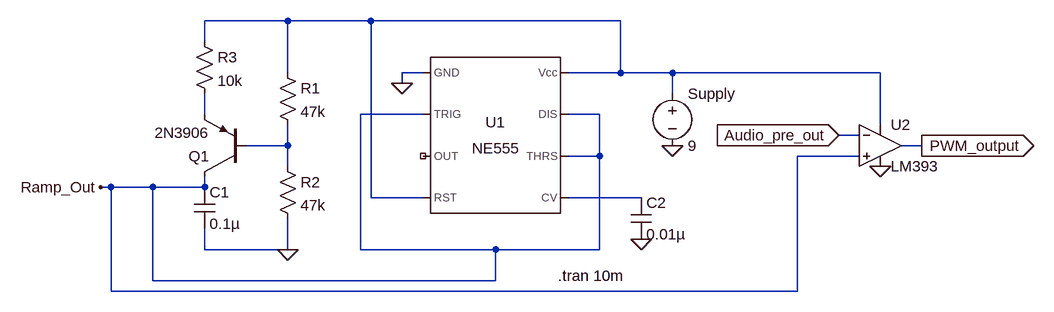
[diagram p0: schematic Tx.asc]
Tx.asc, the LTspice schematic file:
Version 4
SHEET 1 900 680
WIRE -288 -48 -416 -48
WIRE -160 -48 -288 -48
WIRE 224 -48 -160 -48
WIRE -416 -16 -416 -48
WIRE -288 32 -288 -48
WIRE -80 32 -112 32
WIRE 224 32 224 -48
WIRE 224 32 144 32
WIRE 304 32 224 32
WIRE 624 32 304 32
WIRE -112 48 -112 32
WIRE 304 64 304 32
WIRE -416 96 -416 64
WIRE -80 96 -176 96
WIRE 192 96 144 96
WIRE 624 112 624 32
WIRE 592 128 560 128
WIRE -288 144 -288 112
WIRE -288 144 -352 144
WIRE 688 144 656 144
WIRE 192 160 192 96
WIRE 192 160 144 160
WIRE 592 160 496 160
WIRE -288 176 -288 144
WIRE -560 208 -576 208
WIRE -496 208 -560 208
WIRE -416 208 -416 192
WIRE -416 208 -496 208
WIRE -160 224 -160 -48
WIRE -80 224 -160 224
WIRE 256 224 144 224
WIRE -416 304 -416 272
WIRE -288 304 -288 256
WIRE -288 304 -416 304
WIRE -176 304 -176 96
WIRE 32 304 -176 304
WIRE 192 304 192 160
WIRE 192 304 32 304
WIRE -496 352 -496 208
WIRE 32 352 32 304
WIRE 32 352 -496 352
WIRE -560 368 -560 208
WIRE 496 368 496 160
WIRE 496 368 -560 368
FLAG 304 144 0
FLAG -112 48 0
FLAG -288 304 0
FLAG 256 288 0
FLAG -576 208 Ramp_Out
FLAG 624 176 0
FLAG 560 128 Audio_pre_out
IOPIN 560 128 In
FLAG 688 144 PWM_output
IOPIN 688 144 Out
SYMBOL voltage 304 48 R0
SYMATTR InstName Supply
SYMATTR Value 9
SYMBOL Misc\\NE555 32 128 R0
SYMATTR InstName U1
SYMBOL pnp -352 192 R180
SYMATTR InstName Q1
SYMATTR Value 2N3906
SYMBOL res -304 16 R0
SYMATTR InstName R1
SYMATTR Value 47k
SYMBOL res -304 160 R0
SYMATTR InstName R2
SYMATTR Value 47k
SYMBOL cap -432 208 R0
SYMATTR InstName C1
SYMATTR Value 0.1µ
SYMBOL res -432 -32 R0
SYMATTR InstName R3
SYMATTR Value 10k
SYMBOL cap 240 224 R0
SYMATTR InstName C2
SYMATTR Value 0.01µ
SYMBOL OpAmps\\opamp2 624 80 R0
SYMATTR InstName U2
SYMATTR Value LM393
TEXT 128 344 Left 2 !.tran 10m

The netlist it stands for:
* Tx.asc
V§Supply N001 0 9
XU1 0 Ramp_Out NC_01 N001 N004 Ramp_Out Ramp_Out N001 NE555  ; pins GND TRIG OUT RST CV THRS DIS Vcc
Q1 Ramp_Out N003 N002 0 2N3906
R1 N001 N003 47k
R2 N003 0 47k
C1 Ramp_Out 0 0.1µ
R3 N001 N002 10k
C2 N004 0 0.01µ
XU2 Ramp_Out Audio_pre_out N001 0 PWM_output LM393  ; pins In+ In- V+ V- OUT
.model NPN NPN
.model PNP PNP
.lib standard.bjt
.tran 10m
.lib NE555.sub
.backanno
.end